# Altium schematic sheet Isoleeritud_can.SchDoc
size A4
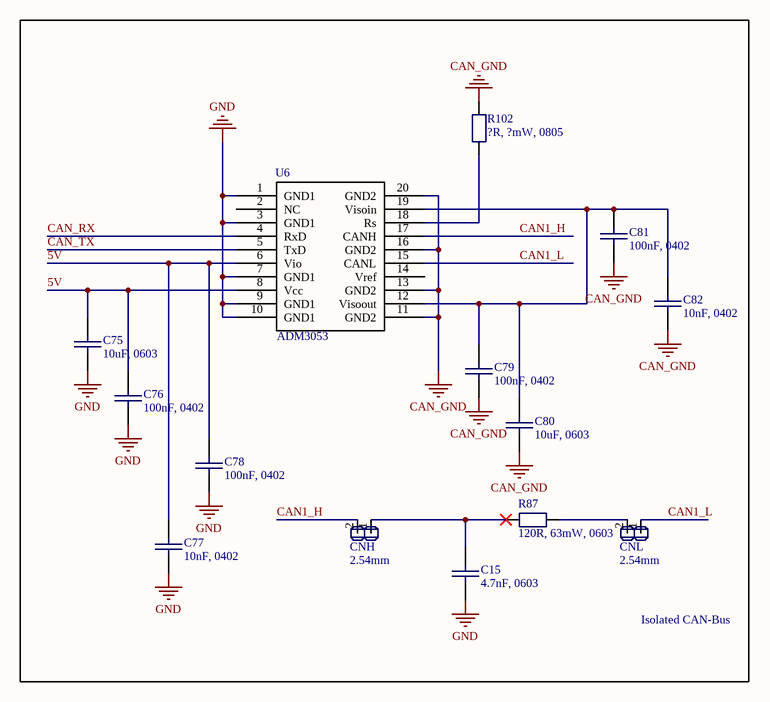
[diagram p0: Isoleeritud_can.SchDoc]

## Parts
C15  4.7nF, 0603  [1608 [0603] CAP]
C75  10uF, 0603  [1608 [0603] CAP]
C76  100nF, 0402  [1005 [0402] CAP]
C77  10nF, 0402  [1005 [0402] CAP]
C78  100nF, 0402  [1005 [0402] CAP]
C79  100nF, 0402  [1005 [0402] CAP]
C80  10uF, 0603  [1608 [0603] CAP]
C81  100nF, 0402  [1005 [0402] CAP]
C82  10nF, 0402  [1005 [0402] CAP]
CNH  2.54mm  [Pin Header 2x1]
CNL  2.54mm  [Pin Header 2x1]
R87  120R, 63mW, 0603  [1608 [0603] RES]
R102  ?R, ?mW, 0805  [1608 [0603] RES]
U6  1  [ADM3053 CAN IC]  (value not drawn)

## Blocks framed on the sheet
Isolated CAN-Bus: C15 C75-C82 CNH CNL R87 R102 U6

## Nets
CAN_GND: C79.2 C80.2 C81.2 C82.2 R102.2 U6.11(GND2) U6.13(GND2) U6.16(GND2) U6.20(GND2)
GND: C15.2 C75.2 C76.2 C77.2 C78.2 U6.1(GND1) U6.3(GND1) U6.7(GND1) U6.9(GND1) U6.10(GND1)
5V: C75.1 C76.1 C77.1 C78.1 U6.6(Vio) U6.8(Vcc)
CAN1_H: CNH.2 U6.17(CANH)
CAN1_L: CNL.1 U6.15(CANL)
CAN_RX: U6.4(RxD)
CAN_TX: U6.5(TxD)
NetC15_1: C15.1 CNH.1 R87.1
NetC79_1: C79.1 C80.1 C81.1 C82.1 U6.12(Visoout) U6.19(Visoin)
NetCNL_2: CNL.2 R87.2
NetR102_1: R102.1 U6.18(Rs)

Not connected (* = marked no-connect by the designer): U6 2(NC) 14(Vref)

## Notes on the sheet
- (in symbol Component_1) ADM3053

## Library data of the parts
C15 C75-C82 = Capacitor: Manufacturer: *; Product Name: *; Supplier Number: *; Supplier: Farnell; Notes: *
CNH CNL = Pin Header 2x1: Manufacturer: *; Product Name: *; Supplier Number: *; Supplier: *; Notes: *
R87 = Resistor: Manufacturer: YAGEO (PHYCOMP); Product Name: RC0603FR-07120RL; Product Number: Farnell 9238379
R102 = Resistor: Manufacturer: *; Product Name: *; Supplier Number: *; Supplier: Farnell; Notes: *
U6 = Component_1